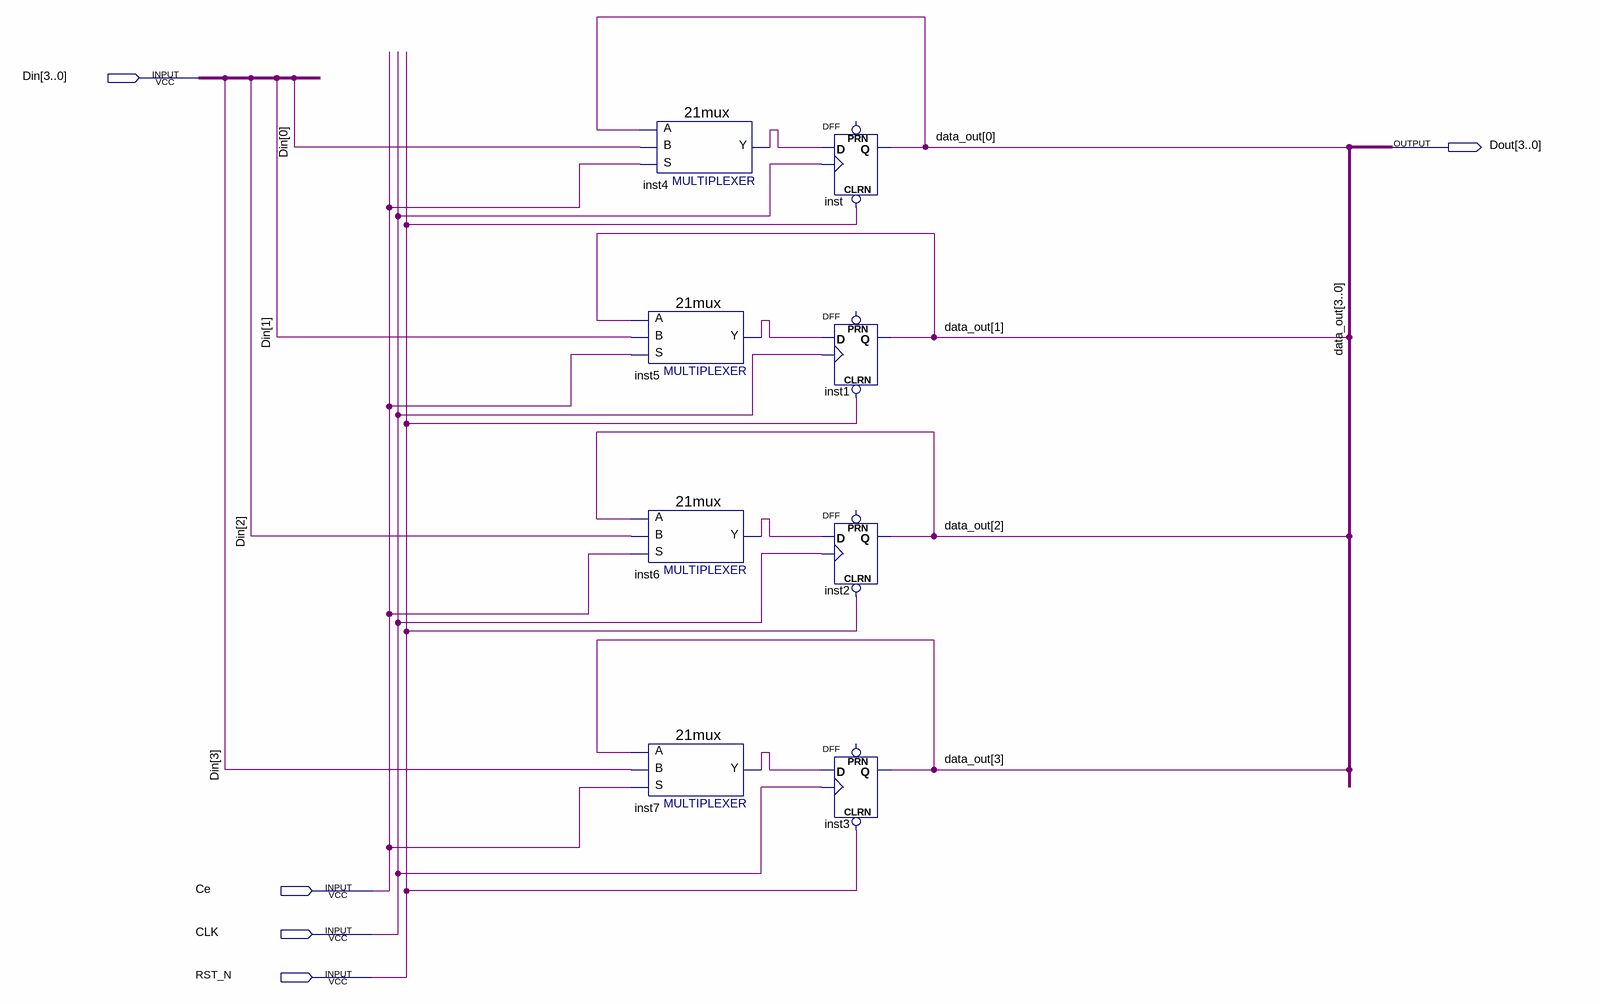
[diagram p0: schematic sheet]
// Quartus schematic four_bit_register.bdf as structural Verilog: 8 symbols, 5 pins
module four_bit_register (
  input  [3:0] Din,
  input  Ce,
  input  CLK,
  input  RST_N,
  output [3:0] Dout
);

  wire inst4_y, inst5_y, inst6_y, inst7_y;

  \21mux  inst5 (.S(Ce), .B(Din[1]), .A(Dout[1]), .Y(inst5_y));
  \21mux  inst6 (.S(Ce), .B(Din[2]), .A(Dout[2]), .Y(inst6_y));
  \21mux  inst7 (.S(Ce), .B(Din[3]), .A(Dout[3]), .Y(inst7_y));
  \21mux  inst4 (.S(Ce), .B(Din[0]), .A(Dout[0]), .Y(inst4_y));
  DFF inst (.CLRN(RST_N), .CLK(CLK), .D(inst4_y), .Q(Dout[0]));  // open: PRN
  DFF inst1 (.CLRN(RST_N), .CLK(CLK), .D(inst5_y), .Q(Dout[1]));  // open: PRN
  DFF inst2 (.CLRN(RST_N), .CLK(CLK), .D(inst6_y), .Q(Dout[2]));  // open: PRN
  DFF inst3 (.CLRN(RST_N), .CLK(CLK), .D(inst7_y), .Q(Dout[3]));  // open: PRN

  // Other names for the same wires on the sheet: data_out[3:0] = Dout
endmodule
